# Altium schematic sheet DriverAndProtection.SchDoc: Drive and protections
size A4; CheckedBy: Hildo Guillardi Júnior; Author: Fellipe; Organization: UNICAMP / LCEE; Address1: University of Campinas - Brazil; Address2: Power Conditioning Laboratory; Address3: Licensed by GNU GPL 3.0; ProjectName: Easy Inverter
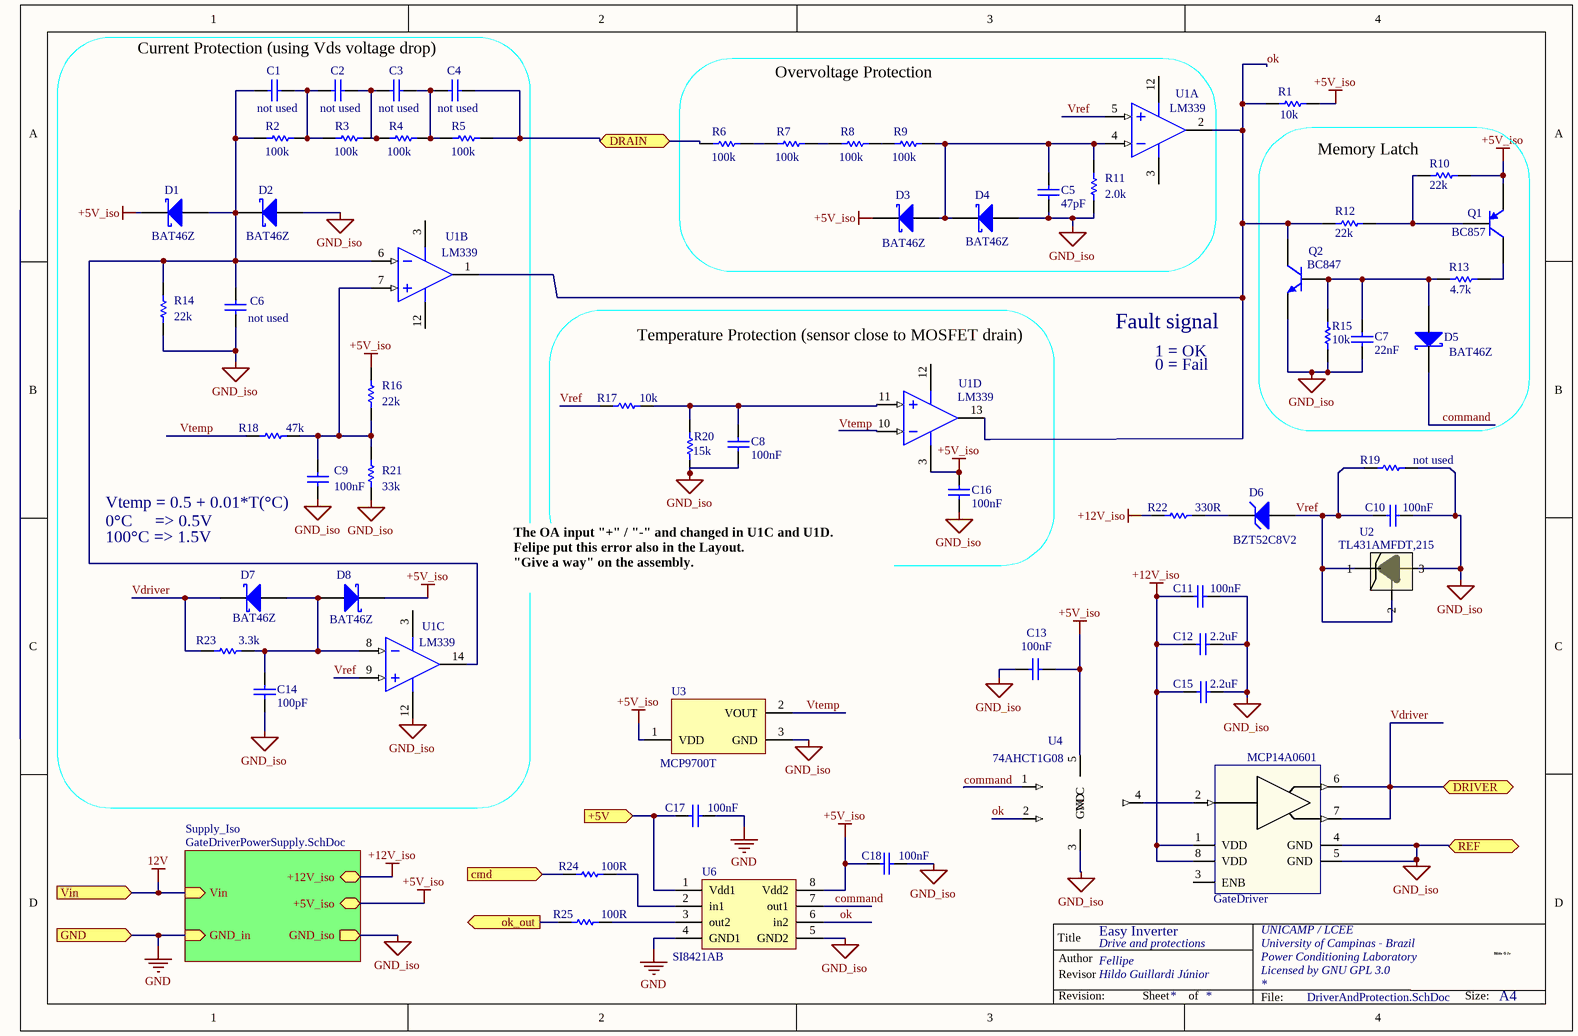
[diagram p0: DriverAndProtection.SchDoc]

## Parts
C1  value not used  [0805_W]
C2  value not used  [0805_W]
C3  value not used  [0805_W]
C4  value not used  [0805_W]
C5  value 47pF  [0805_W]
C6  value not used  [0805_W]
C7  value 22nF  [0805_W]
C8  value 100nF  [0805_W]
C9  value 100nF  [0805_W]
C10  value 100nF  [0805_W]
C11  value 100nF  [0805_W]
C12  value 2.2uF  [0805_W]
C13  value 100nF  [0805_W]
C14  value 100pF  [0805_W]
C15  value 2.2uF  [0805_W]
C16  value 100nF  [0805_W]
C17  value 100nF  [0805_W]
C18  value 100nF  [0805_W]
D1  value BAT46Z  [SOD-123]
D2  value BAT46Z  [SOD-123]
D3  value BAT46Z  [SOD-123]
D4  value BAT46Z  [SOD-123]
D5  value BAT46Z  [SOD-123]
D6  value BZT52C8V2  [SOD-123]
D7  value BAT46Z  [SOD-123]
D8  value BAT46Z  [SOD-123]
GateDriver  value MCP14A0601  [SOIC-8N]
Q1  value BC857  [SOT-23-TT3_N]
Q2  value BC847  [SOT-23-TT3_N]
R1  value 10k  [0805_W]
R2  value 100k  [0805_W]
R3  value 100k  [0805_W]
R4  value 100k  [0805_W]
R5  value 100k  [0805_W]
R6  value 100k  [0805_W]
R7  value 100k  [0805_W]
R8  value 100k  [0805_W]
R9  value 100k  [0805_W]
R10  value 22k  [0805_W]
R11  value 2.0k  [0805_W]
R12  value 22k  [0805_W]
R13  value 4.7k  [0805_W]
R14  value 22k  [0805_W]
R15  value 10k  [0805_W]
R16  value 22k  [0805_W]
R17  value 10k  [0805_W]
R18  value 47k  [0805_W]
R19  value not used  [0805_W]
R20  value 15k  [0805_W]
R21  value 33k  [0805_W]
R22  value 330R  [0805_W]
R23  value 3.3k  [0805_W]
R24  value 100R  [0805_W]
R25  value 100R  [0805_W]
U1  value LM339  [SOIC-14N]  (parts A,B,C,D of 4)
U2  value TL431AMFDT,215  [SOT-23-TT3_M]
U3  value MCP9700T  [SOT-23_L]
U4  value 74AHCT1G08  [SOT353]
U6  value SI8421AB  [SOIC-8N]

## Blocks framed on the sheet
Overvoltage Protection: C5 D3 D4 R6-R9 R11 U1
Memory Latch: C7 D5 Q1 Q2 R10 R12 R13 R15
Temperature Protection (sensor close to MOSFET drain): C8 C16 R17 R20 U1

## Sub-sheets
Supply_Iso = GateDriverPowerSupply.SchDoc: +12V_iso (bidir), +5V_iso (bidir), GND_iso (out), GND_in (in), Vin (in)

## Ports
+5V (in), cmd (in), DRAIN, DRIVER, GND (in), ok_out (out), REF, Vin (in)

## Nets
12V: port Vin, sheet Supply_Iso/Vin
+5V_iso: C13.1 C16.1 C18.2 D1.2(K) D3.2(K) D8.2(K) Q1.2(E) R1.2 R10.1 R16.2 U1.3(V+) U3.1(VDD) U4.5(VCC) U6.8(Vdd2) ; sheet Supply_Iso/+5V_iso
+12V_iso: C11.2 C12.1 C15.1 GateDriver.1(VDD) GateDriver.8(VDD) R22.1 ; sheet Supply_Iso/+12V_iso
GND: C17.1 U6.4(GND1) ; port GND, sheet Supply_Iso/GND_in
GND_iso: C5.2 C6.2 C7.2 C8.2 C9.2 C10.2 C11.1 C12.2 C13.2 C14.2 C15.2 C16.2 C18.1 D2.1(A) D4.1(A) GateDriver.4(GND) GateDriver.5(GND) Q2.2(E) R11.1 R14.1 R15.2 R19.2 R20.2 R21.2 U1.12(V-) U2.3 U3.3(GND) U4.3(GND) U6.5(GND2) ; port REF, sheet Supply_Iso/GND_iso
+5V: C17.2 U6.1(Vdd1) ; port +5V
cmd: R24.2 ; port cmd
command: D5.2(K) U4.1(OE*) U6.7(out1)
DRAIN: C4.1 R5.2 R6.2 ; port DRAIN
ok: Q2.3(C) R1.1 R12.2 U1.1(OUT) U1.2(OUT) U1.13(OUT) U4.2(IN) U6.6(in2)
ok_out: R25.2 ; port ok_out
Vdriver: D7.2(K) GateDriver.6 GateDriver.7 R23.2 ; port DRIVER
Vref: C10.1 D6.1(A) R17.2 R19.1 U1.5(IN+) U1.9(IN+) U2.1 U2.2
Vtemp: R18.2 U3.2(VOUT)
NetC1_1: C1.1 C2.2 R2.2 R3.2
NetC1_2: C1.2 C6.1 D1.1(A) D2.2(K) R2.1 R14.2 U1.6(IN-) U1.14(OUT)
NetC2_1: C2.1 C3.2 R3.1 R4.2
NetC3_1: C3.1 C4.2 R4.1 R5.1
NetC5_1: C5.1 D3.1(A) D4.2(K) R9.1 R11.2 U1.4(IN-)
NetC7_1: C7.1 D5.1(A) Q2.1(B) R13.2 R15.1
NetC8_1: C8.1 R17.1 R20.1 U1.11(IN+)
NetC9_1: C9.1 R16.1 R18.1 R21.1 U1.7(IN+)
NetC14_1: C14.1 D7.1(A) D8.1(A) R23.1 U1.8(IN-)
NetD6_2: D6.2(K) R22.2
NetGateDriver_2: GateDriver.2 U4.4(OUT)
NetQ1_1: Q1.1(B) R10.2 R12.1
NetQ1_3: Q1.3(C) R13.1
NetR6_1: R6.1 R7.2
NetR7_1: R7.1 R8.2
NetR8_1: R8.1 R9.2
NetR24_1: R24.1 U6.2(in1)
NetR25_1: R25.1 U6.3(out2)

Not connected (* = marked no-connect by the designer): GateDriver 3(ENB); U1 10(IN-)

## Notes on the sheet
- Current Protection (using Vds voltage drop)
- (near Q2) Fault signal
- 1 = OK
- 0 = Fail
- (near C9) Vtemp = 0.5 + 0.01*T(°C)
- 0°C     => 0.5V
- 100°C => 1.5V
- The OA input "+" / "-" and changed in U1C and U1D.
  Felipe put this error also in the Layout.
  "Give a way" on the assembly.
- Labels drawn without touching a wire or pin: Vtemp
- Title
- Author
- Revisor
- Hildo G Jr
- Revision:
- Sheet
- of
- File:
- Size:
- A4
- HGJr

## Library data of the parts
C1-C4 C6 = Cap_0805: Capacitor
  C1-C4: Published: 8-Jun-2000; LatestRevisionDate: 17-Jul-2002; LatestRevisionNote: Re-released for DXP Platform.; PackageReference: RAD-0.3; Publisher: Altium Limited
C5 = Cap_0805: Capacitor; pn: C0805C473K8RAC7800
C7 = Cap_0805: Capacitor; pn: C0805C223K8RACTU
C8-C11 C17 C18 = Cap_0805: Capacitor; pn: 08053C104KAT2A
C12 C15 = Capacitor_nao_polarizado: Capacitor nao polarizado; pn: 08053C225KAT2A
C13 C16 = Cap_0805: Capacitor; pn: C0805C104K8RACTU
C14 = Cap_0805: Capacitor; pn: 08053C101KAT2A
D1-D4 D7 D8 = D Schottky: Schottky Diode; pn: BAT46ZFILM
D5 = Schottky: Diodo Schottky; pn: BAT46ZFILM
D6 = D Zener: Zener Diode; pn: BZT52C8V2-FDICT-ND
GateDriver = GateDriver: pn: MIC4420YM-TR;MIC4422ZM
Q1 = BC857: PNP General-purpose Transistor; pn: BC857BLT1G
Q2 = BC847: NPN General-purpose Transistor; pn: BC847BLT1G
R1 R17 = Res_0805: Resistor; pn: RMCF0805JT10K0
R2-R9 = Res_0805: Resistor; pn: RMCF0805JT100K
R10 = Res_0805: Resistor- Not Used; pn: RMCF0805JT22K0
R11 = Res_0805: Resistor; pn: RMCF0805JT2K00
R12 R16 = Res_0805: Resistor; pn: RMCF0805JT22K0
R13 = Res_0805: Resistor; pn: RMCF0805JT4K70
R14 = Res_0805: Resistor; pn: RMCF0805JT560K
R15 = Res_0805: Resistor- Not Used; pn: RMCF0805JT10K0
R18 = Res_0805: Resistor; pn: RMCF0805JT5K60
R19 = Res_0805: Resistor- Not Used
R20 = Res_0805: Resistor; pn: RMCF0805JT15K0
R21 = Res_0805: Resistor; pn: RMCF0805JT33K0
R22 = Res_0805: Resistor- Not Used; pn: RMCF0805JT330R
R23 = Res_0805: Resistor; pn: RMCF0805JT3k30
R24 R25 = Res_0805: Resistor; pn: RMCF0805JT100R
U1 = LM339AD: Low-Power Quad Voltage Comparator; pn: LM339DT
U2 = TL431ACLP: pn: TL431AMFDT\,215
U3 = MCP9700T-E/TT: Low-Power Linear Active Thermistor IC, 3-Pin SOT-23, Extended Temperature, Tape and Reel; pn: MCP9700T-E/TT
U4 = AND: pn: 74AHCT1G08SE-7
U6 = Si8421: Two Channel, High Speed Digital Isolators; pn: SI8421AB-D-IS;SI8422BB-D-IS;FOD8012A